# Altium schematic sheet Copy of N-DAP_with connectors.SchDoc
size A4; DocumentNumber: 1; SheetNumber: 1; SheetTotal: 1; PageSetup: Record=PageOptions|CenterHorizontal=True|CenterVertical=True|PrintScale=0.05|XCorrection=1.00|YCorrection=1.00|PrintKind=0|BorderSize=5000000|LeftOffset=0|BottomOffset=0|Orientation=2|PaperLength=1000|PaperWidth=1000|Scale=100|PaperSource=7|PrintQuality=-3|MediaType=1|DitherType=10|PrintScaleMode=1|PaperKind=12mm|PaperIndex=126
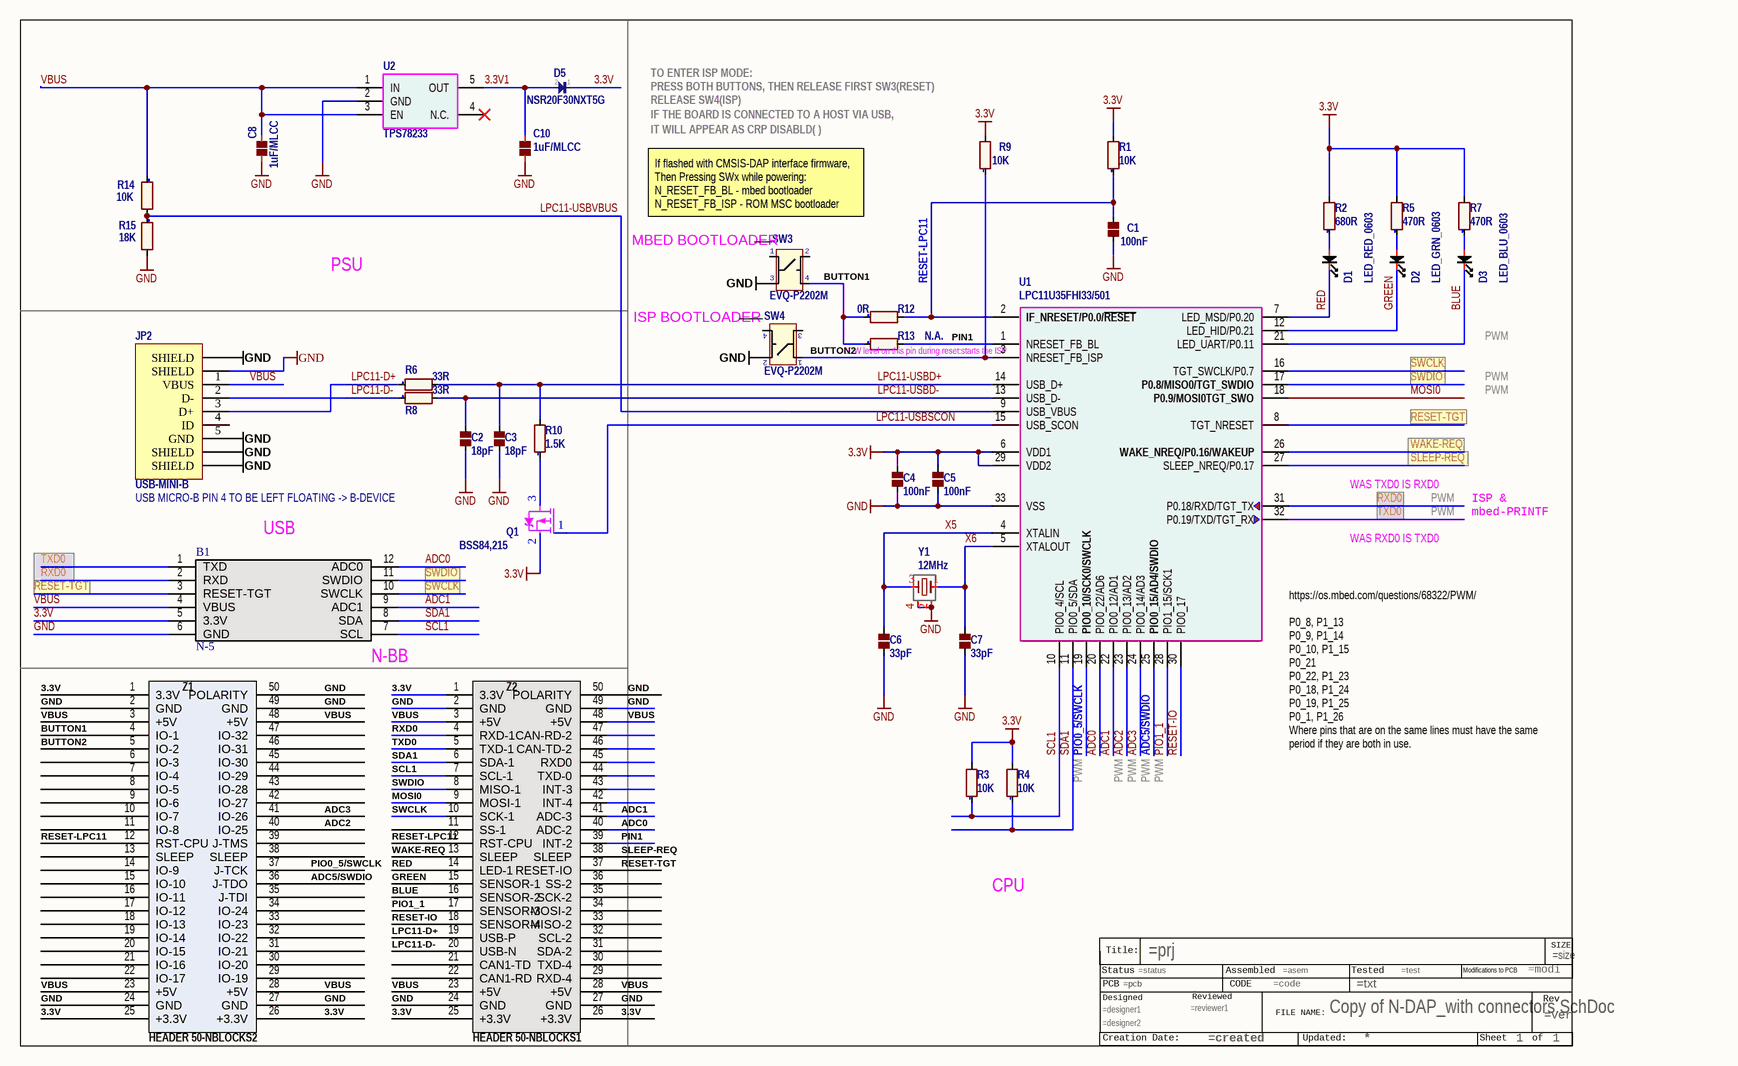
[diagram p0: Copy of N-DAP_with connectors.SchDoc]

## Parts
?*??  FILE_NAME: Copy of N-DAP_with connectors.SchDoc  PAGE NUMPER: 1  (hidden comment: TITLEBLOCK3)  (graphical)
B1  N-5  [N-5]
C1  100nF  [0603_CAP_SMALL]
C2  18pF  [0603_CAP_SMALL]
C3  18pF  [0603_CAP_SMALL]
C4  100nF  [0603_CAP_SMALL]
C5  100nF  [0603_CAP_SMALL]
C6  33pF  [0603_CAP_SMALL]
C7  33pF  [0603_CAP_SMALL]
C8  1uF/MLCC  [0603_CAP_SMALL]
C10  1uF/MLCC  [0603_CAP_SMALL]
D1  LED_RED_0603  [0603_LED_RED]
D2  LED_GRN_0603  [0603_LED_GRN]
D3  LED_BLU_0603  [0603_LED_BLU]
D5  NSR20F30NXT5G  [0603_DIODE-NSR20F30]
JP2  USB-MINI-B  [USB-MINI-B-HIR-UX60A-MB-5ST-SMALL]
Q1  BSS84,215  [SOT323/SC70-3_SMALL]
R1  10K  [0603_res_SMALL]
R2  680R  [0603_res_SMALL]
R3  10K  [0603_res_SMALL]
R4  10K  [0603_res_SMALL]
R5  470R  [0603_res_SMALL]
R6  33R  [0603_res_SMALL]
R7  470R  [0603_res_SMALL]
R8  33R  [0603_res_SMALL]
R9  10K  [0603_res_SMALL]
R10  1.5K  [0603_res_SMALL]
R12  0R  [0603_res_SMALL]
R13  N.A.  [0603_res_SMALL]  (no BOM)
R14  10K  [0603_res_SMALL]
R15  18K  [0603_res_SMALL]
SW3  EVQ-P2202M  [BUTTON_4.7x3.5mm]
SW4  EVQ-P2202M  [BUTTON_4.7x3.5mm]
U1  LPC11U35FHI33/501  [QFN32_0.5mm_PAD]
U2  TPS78233  [SOT23-5_0.95mm-NOSILK]
Y1  12MHz  [CRY-SMD4-2.5x2mm]
Z1  HEADER 50-NBLOCKS2  [MOLEX-5037765020]
Z2  HEADER 50-NBLOCKS1  [MOLEX-5037765020]

## Nets
3.3V: B1.5(3.3V) C4.1 C5.1 D5.1 Q1.2(S) R1.2 R2.2 R3.2 R4.2 R5.2 R7.2 R9.2 U1.6(VDD1) U1.29(VDD2) Z1.1(3.3V) Z1.25(+3.3V) Z1.26(+3.3V) Z2.1(3.3V) Z2.25(+3.3V) Z2.26(+3.3V)
GND: B1.6(GND) C1.2 C2.2 C3.2 C4.2 C5.2 C6.2 C7.2 C8.1 C10.1 JP2.5(GND) JP2.6(SHIELD) JP2.7(SHIELD) JP2.8(SHIELD) JP2.9(SHIELD) R15.2 SW3.3 SW4.2 U1.33(VSS) U2.2(GND) Y1.2 Y1.4 Z1.2(GND) Z1.24(GND) Z1.27(GND) Z1.49(GND) Z1.50(POLARITY) Z2.2(GND) Z2.24(GND) Z2.27(GND) Z2.49(GND) Z2.50(POLARITY)
3.3V1: C10.2 D5.2 U2.5(OUT)
ADC0: B1.12(ADC0) U1.20(PIO0_22/AD6) Z2.40(ADC-2)
ADC1: B1.9(ADC1) U1.22(PIO0_12/AD1) Z2.41(ADC-3)
ADC2: U1.23(PIO0_13/AD2) Z1.40(IO-25)
ADC3: U1.24(PIO0_14/AD3) Z1.41(IO-26)
ADC5/SWDIO: U1.25(PIO0_15/AD4/SWDIO) Z1.36(J-TDO)
BLUE: D3.2 U1.21(LED_UART/P0.11) Z2.16(SENSOR-2)
BUTTON1: R12.1 R13.1 SW3.4 Z1.4(IO-1)
BUTTON2: R9.1 SW4.1 U1.3(NRESET_FB_ISP) Z1.5(IO-2)
GREEN: D2.2 U1.12(LED_HID/P0.21) Z2.15(SENSOR-1)
LPC11-D+: JP2.3(D+) R6.1 Z2.19(USB-P)
LPC11-D-: JP2.2(D-) R8.1 Z2.20(USB-N)
LPC11-USBD+: C3.1 R6.2 R10.2 U1.14(USB_D+)
LPC11-USBD-: C2.1 R8.2 U1.13(USB_D-)
LPC11-USBSCON: Q1.1(G) U1.15(USB_SCON)
LPC11-USBVBUS: R14.2 R15.1 U1.9(USB_VBUS)
MOSI0: U1.18(P0.9/MOSI0TGT_SWO) Z2.9(MOSI-1)
PIN1: R13.2 U1.1(NRESET_FB_BL) Z2.39(INT-2)
PIO0_5/SWCLK: U1.19(PIO0_10/SCK0/SWCLK) Z1.37(J-TCK)
PIO1_1: U1.28(PIO1_15/SCK1) Z2.17(SENSOR-3)
RED: D1.2 U1.7(LED_MSD/P0.20) Z2.14(LED-1)
RESET-IO: U1.30(PIO0_17) Z2.18(SENSOR-4)
RESET-LPC11: C1.1 R1.1 R12.2 U1.2(IF_NRESET/P0.0/~{RESET}) Z1.12(RST-CPU) Z2.12(RST-CPU)
RESET-TGT: B1.3(RESET-TGT) U1.8(TGT_NRESET) Z2.37(RESET-IO)
RXD0: B1.2(RXD) U1.31(P0.18/RXD/TGT_TX) Z2.4(RXD-1)
SCL1: B1.7(SCL) R3.1 U1.10(PIO0_4/SCL) Z2.7(SCL-1)
SDA1: B1.8(SDA) R4.1 U1.11(PIO0_5/SDA) Z2.6(SDA-1)
SLEEP-REQ: U1.27(SLEEP_NREQ/P0.17) Z2.38(SLEEP)
SWCLK: B1.10(SWCLK) U1.16(TGT_SWCLK/P0.7) Z2.10(SCK-1)
SWDIO: B1.11(SWDIO) U1.17(P0.8/MISO0/TGT_SWDIO) Z2.8(MISO-1)
TXD0: B1.1(TXD) U1.32(P0.19/TXD/TGT_RX) Z2.5(TXD-1)
VBUS: B1.4(VBUS) C8.2 JP2.1(VBUS) R14.1 U2.1(IN) U2.3(EN) Z1.3(+5V) Z1.23(+5V) Z1.28(+5V) Z1.48(+5V) Z2.3(+5V) Z2.23(+5V) Z2.28(+5V) Z2.48(+5V)
WAKE-REQ: U1.26(WAKE_NREQ/P0.16/WAKEUP) Z2.13(SLEEP)
X5: C6.1 U1.4(XTALIN) Y1.3
X6: C7.1 U1.5(XTALOUT) Y1.1
NetD1_1: D1.1 R2.1
NetD2_1: D2.1 R5.1
NetD3_1: D3.1 R7.1
NetQ1_3: Q1.3(D) R10.1

Not connected (* = marked no-connect by the designer): ?*?? ?1; JP2 4(ID); SW3 1 2; SW4 3 4; U2 4(N.C.)*; Z1 6(IO-3) 7(IO-4) 8(IO-5) 9(IO-6) 10(IO-7) 11(IO-8) 13(SLEEP) 14(IO-9) 15(IO-10) 16(IO-11) 17(IO-12) 18(IO-13) 19(IO-14) 20(IO-15) 21(IO-16) 22(IO-17) 29(IO-19) 30(IO-20) 31(IO-21) 32(IO-22) 33(IO-23) 34(IO-24) 35(J-TDI) 38(SLEEP) 39(J-TMS) 42(IO-27) 43(IO-28) 44(IO-29) 45(IO-30) 46(IO-31) 47(IO-32); Z2 11(SS-1) 21(CAN1-TD) 22(CAN1-RD) 29(RXD-4) 30(TXD-4) 31(SDA-2) 32(SCL-2) 33(MISO-2) 34(MOSI-2) 35(SCK-2) 36(SS-2) 42(INT-4) 43(INT-3) 44(TXD-0) 45(RXD0) 46(CAN-TD-2) 47(CAN-RD-2)

## Notes on the sheet
- TO ENTER ISP MODE:
- PRESS BOTH BUTTONS, THEN RELEASE FIRST SW3(RESET)
- RELEASE SW4(ISP)
- IF THE BOARD IS CONNECTED TO A HOST VIA USB,
- IT WILL APPEAR AS CRP DISABLD( )
- (near SW3) MBED BOOTLOADER
- (near SW3) If flashed with CMSIS-DAP interface firmware,
  Then Pressing SWx while powering:
  N_RESET_FB_BL - mbed bootloader
  N_RESET_FB_ISP - ROM MSC bootloader
- PSU
- ISP BOOTLOADER
- LOW level on this pin during reset:starts the ISP
- PWM
- (near JP2) USB MICRO-B PIN 4 TO BE LEFT FLOATING -> B-DEVICE
- (near B1) USB
- WAS TXD0 IS RXD0
- ISP &
- mbed-PRINTF
- WAS RXD0 IS TXD0
- (near B1) N-BB
- (near U1) https://os.mbed.com/questions/68322/PWM/
  P0_8, P1_13
  P0_9, P1_14
  P0_10, P1_15
  P0_21
  P0_22, P1_23
  P0_18, P1_24
  P0_19, P1_25
  P0_1, P1_26
  Where pins that are on the same lines must have the same period if they are both in use.
- CPU
- (in symbol TITLEBLOCK3) SIZE; Title:; Status; Assembled; Tested; Modifications to PCB; PCB; CODE; Designed; Reviewed; Rev; FILE NAME:; Creation Date:; Updated:; Sheet; of

## Library data of the parts
C1 C4 C5 = C: CAPACITOR; Divider: 1; S.Description: Multilayer Ceramic Capacitors MLCC - SMD/SMT 50volts 0.1uF 10% X7R; Supplier 1: Mouser; Supplier Part Number 1: 581-06035C104KAT2A
C2 C3 = C: CAPACITOR; Divider: 1; Supplier 1: Mouser; Supplier Part Number 1: 581-06031A180GAT2A
C6 C7 = C: CAPACITOR; Divider: 1; S.Description: Multilayer Ceramic Capacitors MLCC - SMD/SMT 50volts 33pF 5% C0G; Supplier 1: Mouser; Supplier Part Number 1: 581-06035A330J
C8 C10 = C: CAPACITOR; Divider: 1; S.Description: Multilayer Ceramic Capacitors MLCC - SMD/SMT 0603 1.0uF 16volts X7R 10%; Supplier 1: Mouser; Supplier Part Number 1: 81-GCM188R71C105K64D
D1 = LED: Divider: 1; S.Description: Standard LEDs - SMD Super Red, 633nm 180mcd, 20mA; S.Footprint: 0704 (1810 metric); Supplier 1: Mouser; Supplier Part Number 1: 720-LSQ976-NR-1
D2 = LED: Divider: 1; S.Description: Standard LEDs - SMD GREEN WATER CLEAR; S.Footprint: 0603 (1608 metric); Supplier 1: Mouser; Supplier Part Number 1: 604-APT1608SGC
D3 = LED: Divider: 1; S.Description: Standard LEDs - SMD Blue, 470nm 45mcd, 5mA; Supplier 1: Mouser; Supplier Part Number 1: 720-LBQ39GL2N2351
D5 = DIODE_NSR20F30: SCHOTTKY DIODE 0603; S.Description: Schottky Diodes & Rectifiers 0603 FC SCHOTTKY DIODES; Divider: 1.3; S.Footprint: 0603; Supplier Part Number 1: 863-NSR20F30NXT5G; Supplier 1: Mouser
JP2 = USB-MINI-B: Divider: 1; S.Description: USB Connectors MINI B RECEPT RA SMT W/O POST; Supplier 1: Mouser; Supplier Part Number 1: 798-UX60A-MB-5ST
Q1 = mosfet BSS84: POWER MOSFET-P SOT23; S.Description: MOSFET -50V 200mW; Divider: 1; Supplier 1: Mouser; Supplier Part Number 1: 621-BSS84W-F
R1 R3 R4 R9 R14 = R: RESISTOR; Divider: 1; S.Description: Thick Film Resistors - SMD 0603 10Kohms 1% Tol; Supplier 1: Mouser; Supplier Part Number 1: 667-ERJ-3EKF1002V
R2 = R: RESISTOR; Divider: 1; S.Description: Thin Film Resistors - SMD 1/16W 680ohm 0.5% 25ppm; Supplier 1: Mouser; Supplier Part Number 1: 754-RR0816P-681D
R5 R7 = R: RESISTOR; Divider: 1; S.Description: Thick Film Resistors - SMD 0603 470ohms 1% Tol; Supplier 1: Mouser; Supplier Part Number 1: 667-ERJ-3EKF4700V
R6 R8 = R: RESISTOR; Divider: 1; S.Description: Thick Film Resistors - SMD 0603 33.0ohms 1% Tol; Supplier 1: Mouser; Supplier Part Number 1: 667-ERJ-3EKF33R0V
R10 = R: RESISTOR; Divider: 1; S.Description: Thick Film Resistors - SMD 0603 1.5Kohms 1% Tol; Supplier 1: Mouser; Supplier Part Number 1: 667-ERJ-3EKF1501V
R12 R13 = R: RESISTOR; Divider: 1; S.Description: Thick Film Resistors - SMD 0603 Zero Ohms; Supplier 1: Mouser; Supplier Part Number 1: 667-ERJ-3GEY0R00V
R15 = R: RESISTOR; Divider: 1; S.Description: Thick Film Resistors - SMD 0603 18Kohms 5% Tol; Supplier 1: Mouser; Supplier Part Number 1: 667-ERJ-3GEYJ183V
SW3 SW4 = BUTTON_TACT: BUTTON TACTILE; S.Description: Tactile Switches 4.7x3.5mm SMD Light Touch Switch; Divider: 1; Supplier 1: Mouser; Supplier Part Number 1: 667-EVQ-P2202M
U1 = LPC11U35FHI33/501: Divider: 1; S.Description: ARM Microcontrollers - MCU 32-bit ARM Cortex-M0 64KB Flash 12KB SRAM; Supplier 1: Mouser; Supplier Part Number 1: 771-LPC11U35FHI33501
U2 = NCP702N: Divider: 1; S.Description: LDO Voltage Regulators Sgl Fixed Out LDO 150mA,1uA Quies Crnt; Supplier 1: Mouser; Supplier Part Number 1: 595-TPS78233DDCR
Y1 = XTAL_4PINS: CRYSTAL; S.Description: Crystals 12MHz 30ppm 18pF -20C +70C; Divider: 1; Supplier 1: Mouser; Supplier Part Number 1: 717-8Z-12.000MAAJ-T
?*?? = TITLEBLOCK3: size: =size; CREATION DATE: =created; UPDATED: *; PAGE COUNT: 1; VERSION: =ver; pr: =prj; ASSEMBLY: =asem; MODIFICATIONS TO OPERATE: =modi; TESTED: =test; PCB: =pcb; STATUS: =status; CODE: =code; TEXT: =txt; designer1: =designer1; designer2: =designer2; reviewer1: =reviewer1